# Altium schematic sheet TINY_PENDANT.SchDoc
size A3; CompanyName: KDS; Organization: KDS; DocumentNumber: 6; Revision: V1I1; SheetNumber: 6; SheetTotal: 6; PageSetup: Record=PageOptions|CenterHorizontal=True|CenterVertical=True|PrintScale=1.07|XCorrection=1.00|YCorrection=1.00|PrintKind=1|BorderSize=5000000|LeftOffset=0|BottomOffset=0|Orientation=2|PaperLength=1000|PaperWidth=1000|Scale=100|PaperSource=7|PrintQuality=600|MediaType=1|DitherType=10|PaperKind=A3|PrintScaleMode=1; ProjectName: KDS C6A816x Module
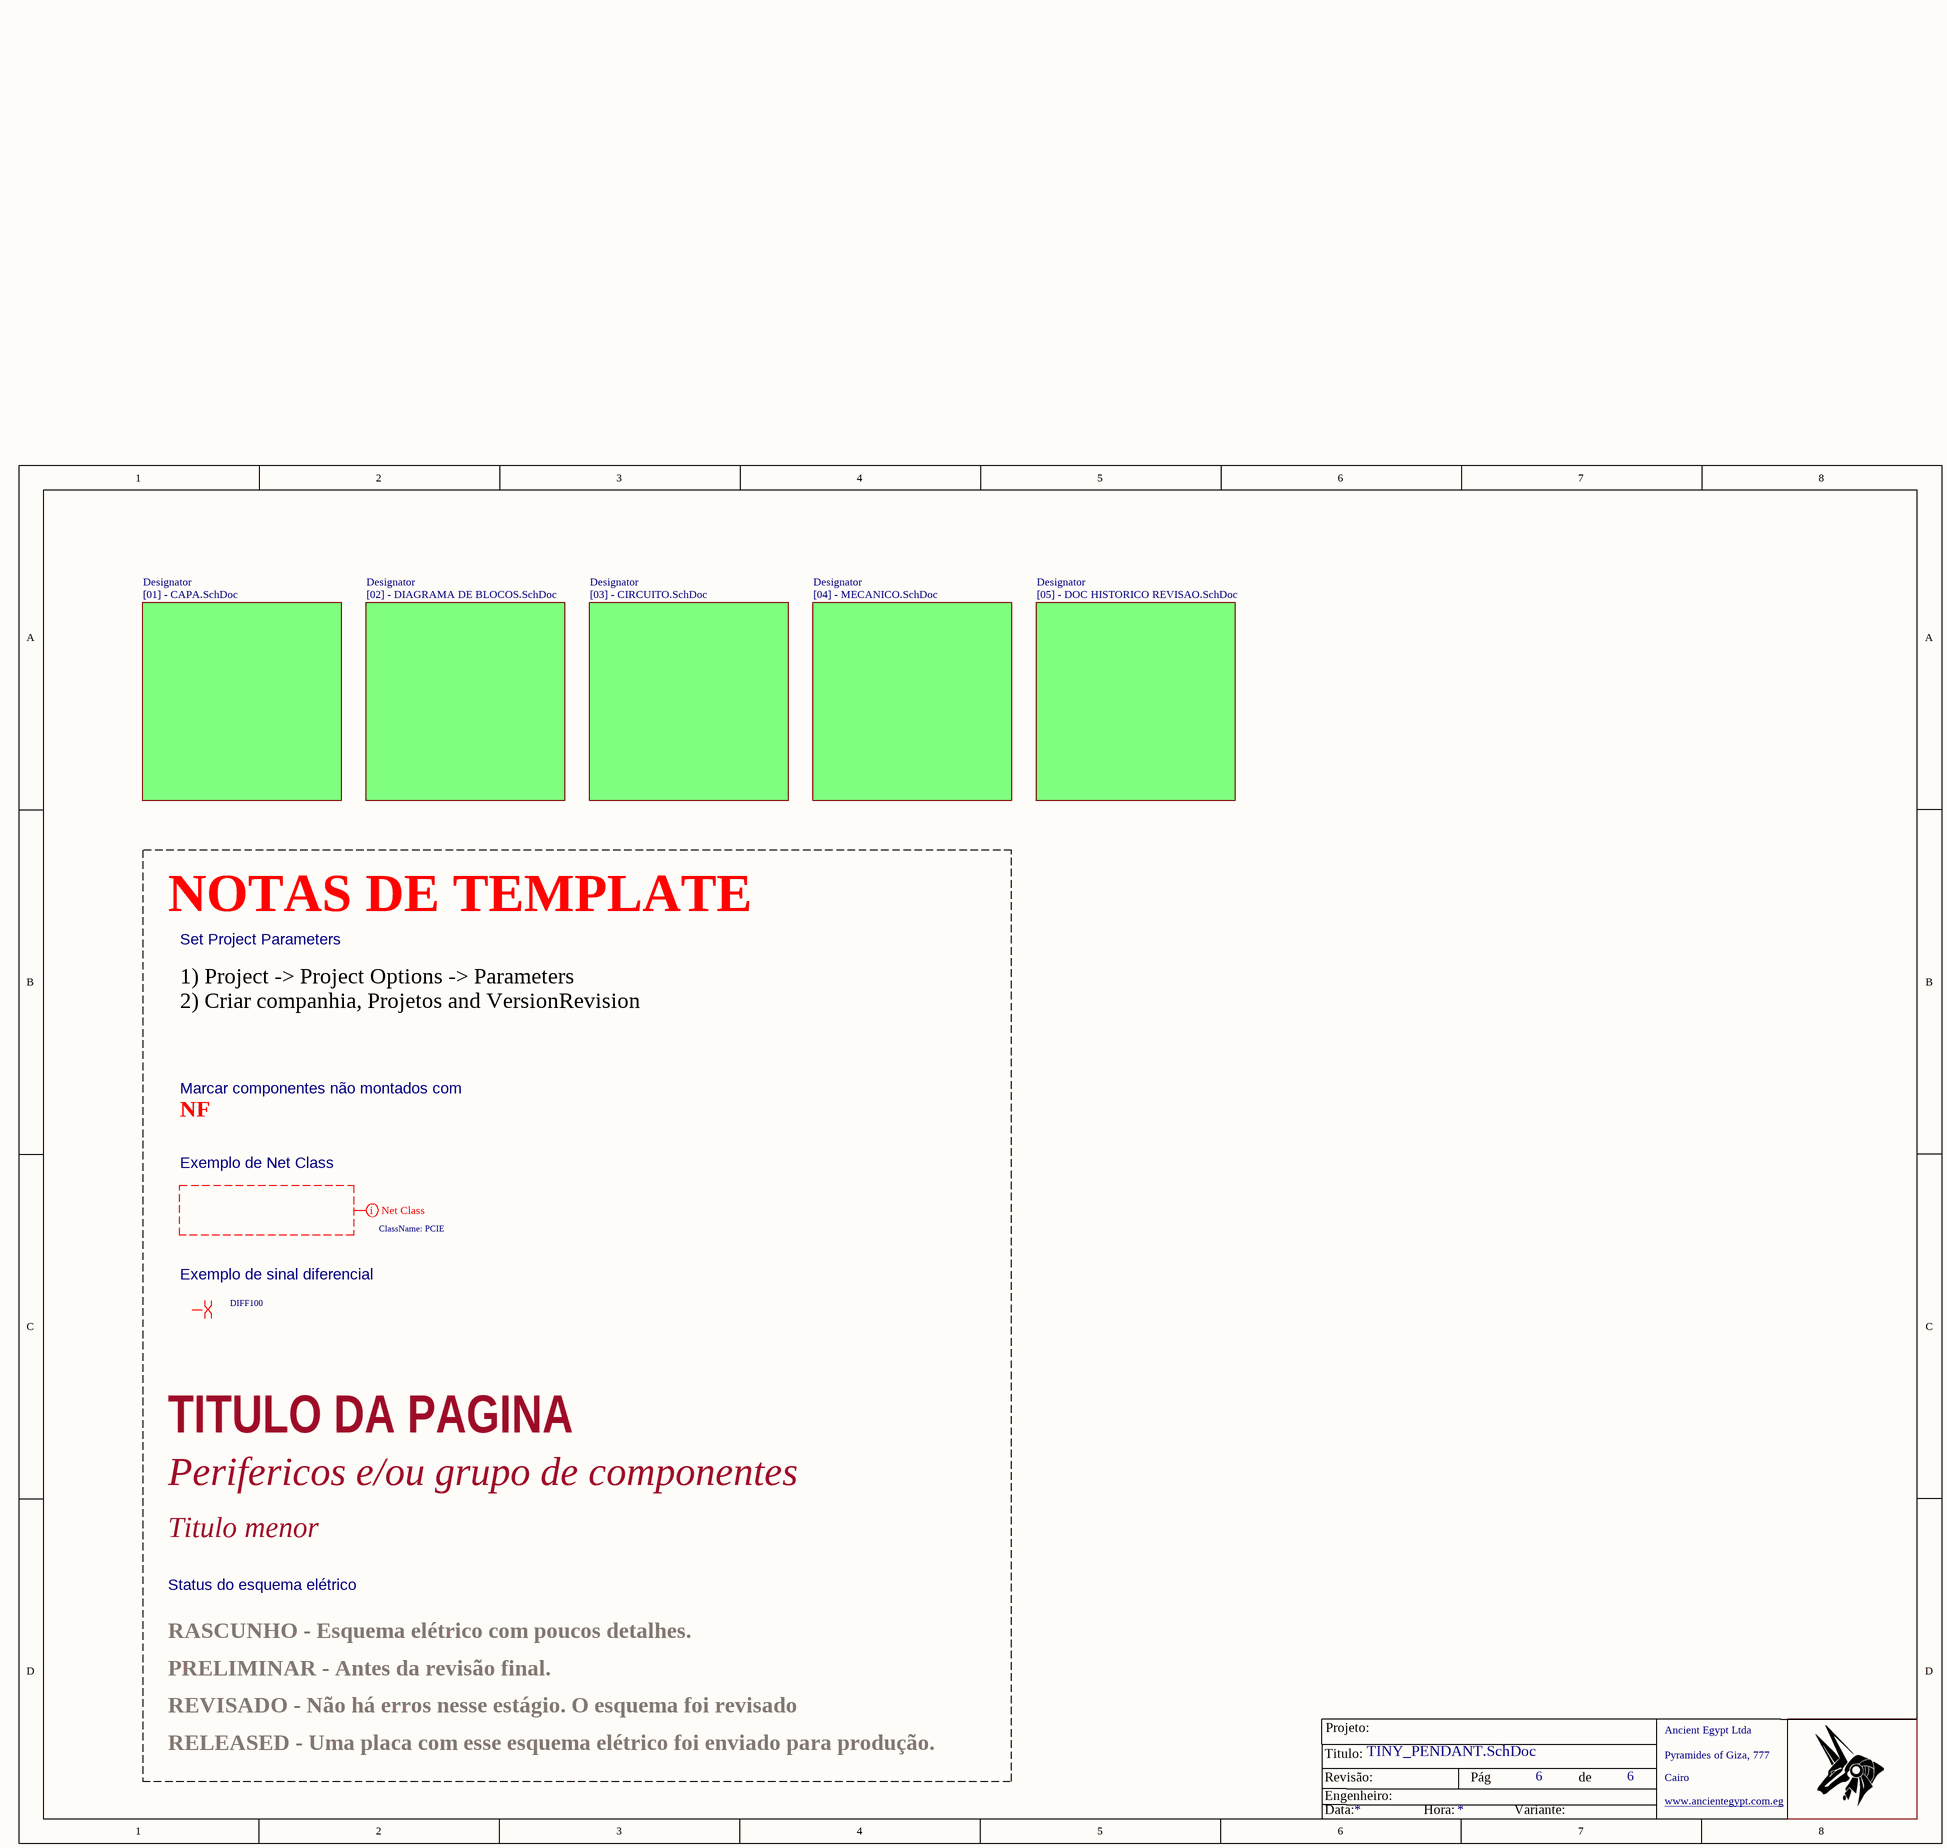
[diagram p0: TINY_PENDANT.SchDoc]

## Sub-sheets
Designator = [01] - CAPA.SchDoc: no entries
Designator = [02] - DIAGRAMA DE BLOCOS.SchDoc: no entries
Designator = [03] - CIRCUITO.SchDoc: no entries
Designator = [04] - MECANICO.SchDoc: no entries
Designator = [05] - DOC HISTORICO REVISAO.SchDoc: no entries

## Layout directives
net class PCIE: (no net found under the mark)
differential pair; net class DIFF100: (no net found under the mark)

## Notes on the sheet
- NOTAS DE TEMPLATE
- Set Project Parameters
- 1) Project -> Project Options -> Parameters
  2) Criar companhia, Projetos and VersionRevision
- NF
- Marcar componentes não montados com
- Exemplo de Net Class
- Exemplo de sinal diferencial
- TITULO DA PAGINA
- Perifericos e/ou grupo de componentes
- Titulo menor
- Status do esquema elétrico
- PRELIMINAR - Antes da revisão final.
- RASCUNHO - Esquema elétrico com poucos detalhes.
- REVISADO - Não há erros nesse estágio. O esquema foi revisado
- RELEASED - Uma placa com esse esquema elétrico foi enviado para produção.
- Projeto:
- Ancient Egypt Ltda
- Revisão:
- Engenheiro:
- Titulo:
- Pág
- de
- Pyramides of Giza, 777
- Cairo
- www.ancientegypt.com.eg
- Data:
- Hora:
- Variante: